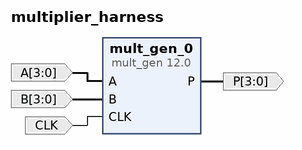
[diagram p0: block diagram of the top level]
# Vivado block design multiplier_harness, Vivado 2014.2
create_bd_design multiplier_harness

create_bd_port -dir I -from 3 -to 0 -type data A
create_bd_port -dir I -from 3 -to 0 -type data B
create_bd_port -dir I -type clk CLK
create_bd_port -dir O -from 3 -to 0 -type data P

create_bd_cell -type ip -vlnv xilinx.com:ip:mult_gen:12.0 mult_gen_0
set_property -dict [list \
  CONFIG.PortAType Unsigned \
  CONFIG.PortAWidth 4 \
  CONFIG.PortBType Unsigned \
  CONFIG.PortBWidth 4 \
  CONFIG.OptGoal Area \
  CONFIG.Use_Custom_Output_Width true \
  CONFIG.OutputWidthHigh 3 \
  CONFIG.PipeStages 2 \
] [get_bd_cells mult_gen_0]

# ---- connections ----

connect_bd_net [get_bd_ports A] [get_bd_pins mult_gen_0/A]
connect_bd_net [get_bd_ports B] [get_bd_pins mult_gen_0/B]
connect_bd_net [get_bd_ports CLK] [get_bd_pins mult_gen_0/CLK]
connect_bd_net [get_bd_pins mult_gen_0/P] [get_bd_ports P]

validate_bd_design
save_bd_design
